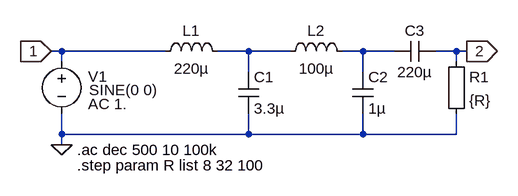
[diagram p0: schematic zvuk-D-filtr.asc]
zvuk-D-filtr.asc, the LTspice schematic file:
Version 4
SHEET 1 880 680
WIRE -96 80 -112 80
WIRE 64 80 -96 80
WIRE 192 80 144 80
WIRE 256 80 192 80
WIRE 368 80 336 80
WIRE 416 80 368 80
WIRE 512 80 480 80
WIRE 528 80 512 80
WIRE -96 96 -96 80
WIRE 512 96 512 80
WIRE 192 112 192 80
WIRE 368 112 368 80
WIRE -96 208 -96 176
WIRE 192 208 192 176
WIRE 192 208 -96 208
WIRE 368 208 368 176
WIRE 368 208 192 208
WIRE 512 208 512 176
WIRE 512 208 368 208
WIRE -96 224 -96 208
FLAG -96 224 0
FLAG 528 80 2
IOPIN 528 80 Out
FLAG -112 80 1
IOPIN -112 80 In
SYMBOL ind 48 96 R270
WINDOW 0 32 56 VTop 2
WINDOW 3 5 56 VBottom 2
SYMATTR InstName L1
SYMATTR Value 220µ
SYMBOL cap 176 112 R0
SYMATTR InstName C1
SYMATTR Value 3.3µ
SYMBOL ind 240 96 R270
WINDOW 0 32 56 VTop 2
WINDOW 3 5 56 VBottom 2
SYMATTR InstName L2
SYMATTR Value 100µ
SYMBOL cap 352 112 R0
SYMATTR InstName C2
SYMATTR Value 1µ
SYMBOL Misc\\EuropeanResistor 496 80 R0
SYMATTR InstName R1
SYMATTR Value {R}
SYMBOL cap 480 64 R90
WINDOW 0 0 32 VBottom 2
WINDOW 3 32 32 VTop 2
SYMATTR InstName C3
SYMATTR Value 220µ
SYMBOL voltage -96 80 R0
WINDOW 123 41 81 Left 2
WINDOW 39 0 0 Left 0
WINDOW 3 42 60 Left 2
WINDOW 0 41 39 Left 2
SYMATTR Value2 AC 1.
SYMATTR Value SINE(0 0)
SYMATTR InstName V1
TEXT -72 232 Left 2 !.ac dec 500 10 100k
TEXT -72 256 Left 2 !.step param R list 8 32 100

The netlist it stands for:
* zvuk-D-filtr.asc
L1 1 N001 220µ
C1 N001 0 3.3µ
L2 N001 N002 100µ
C2 N002 0 1µ
R1 2 0 {R}
C3 2 N002 220µ
V1 1 0 SINE(0 0) AC 1.
.ac dec 500 10 100k
.step param R list 8 32 100
.backanno
.end